# EAGLE design 3way d-sub (EAGLE 7.2.0)
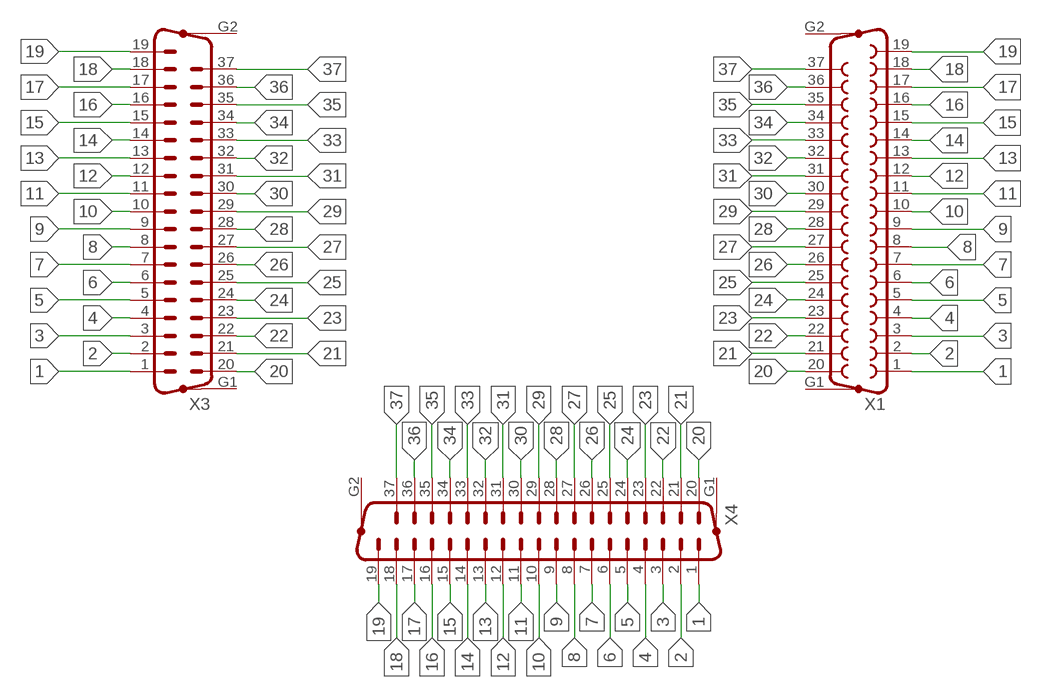
[diagram p0: schematic, sheet 1]

## Parts
X1  F37HP  [F37HP]
X3  M37HP  [M37HP]
X4  M37HP  [M37HP]

## Nets
1: X1.1 X3.1 X4.1
2: X1.2 X3.2 X4.2
3: X1.3 X3.3 X4.3
4: X1.4 X3.4 X4.4
5: X1.5 X3.5 X4.5
6: X1.6 X3.6 X4.6
7: X1.7 X3.7 X4.7
8: X1.8 X3.8 X4.8
9: X1.9 X3.9 X4.9
10: X1.10 X3.10 X4.10
11: X1.11 X3.11 X4.11
12: X1.12 X3.12 X4.12
13: X1.13 X3.13 X4.13
14: X1.14 X3.14 X4.14
15: X1.15 X3.15 X4.15
16: X1.16 X3.16 X4.16
17: X1.17 X3.17 X4.17
18: X1.18 X3.18 X4.18
19: X1.19 X3.19 X4.19
20: X1.20 X3.20 X4.20
21: X1.21 X3.21 X4.21
22: X1.22 X3.22 X4.22
23: X1.23 X3.23 X4.23
24: X1.24 X3.24 X4.24
25: X1.25 X3.25 X4.25
26: X1.26 X3.26 X4.26
27: X1.27 X3.27 X4.27
28: X1.28 X3.28 X4.28
29: X1.29 X3.29 X4.29
30: X1.30 X3.30 X4.30
31: X1.31 X3.31 X4.31
32: X1.32 X3.32 X4.32
33: X1.33 X3.33 X4.33
34: X1.34 X3.34 X4.34
35: X1.35 X3.35 X4.35
36: X1.36 X3.36 X4.36
37: X1.37 X3.37 X4.37
Unconnected: X1.G1 X1.G2 X3.G1 X3.G2 X4.G1 X4.G2

## Library data of the parts
X1 = con-subd:F37HP: SUB-D; OC_FARNELL: unknown; OC_NEWARK: unknown
X3 X4 = con-subd:M37HP: SUB-D; OC_FARNELL: unknown; OC_NEWARK: unknown

## Board
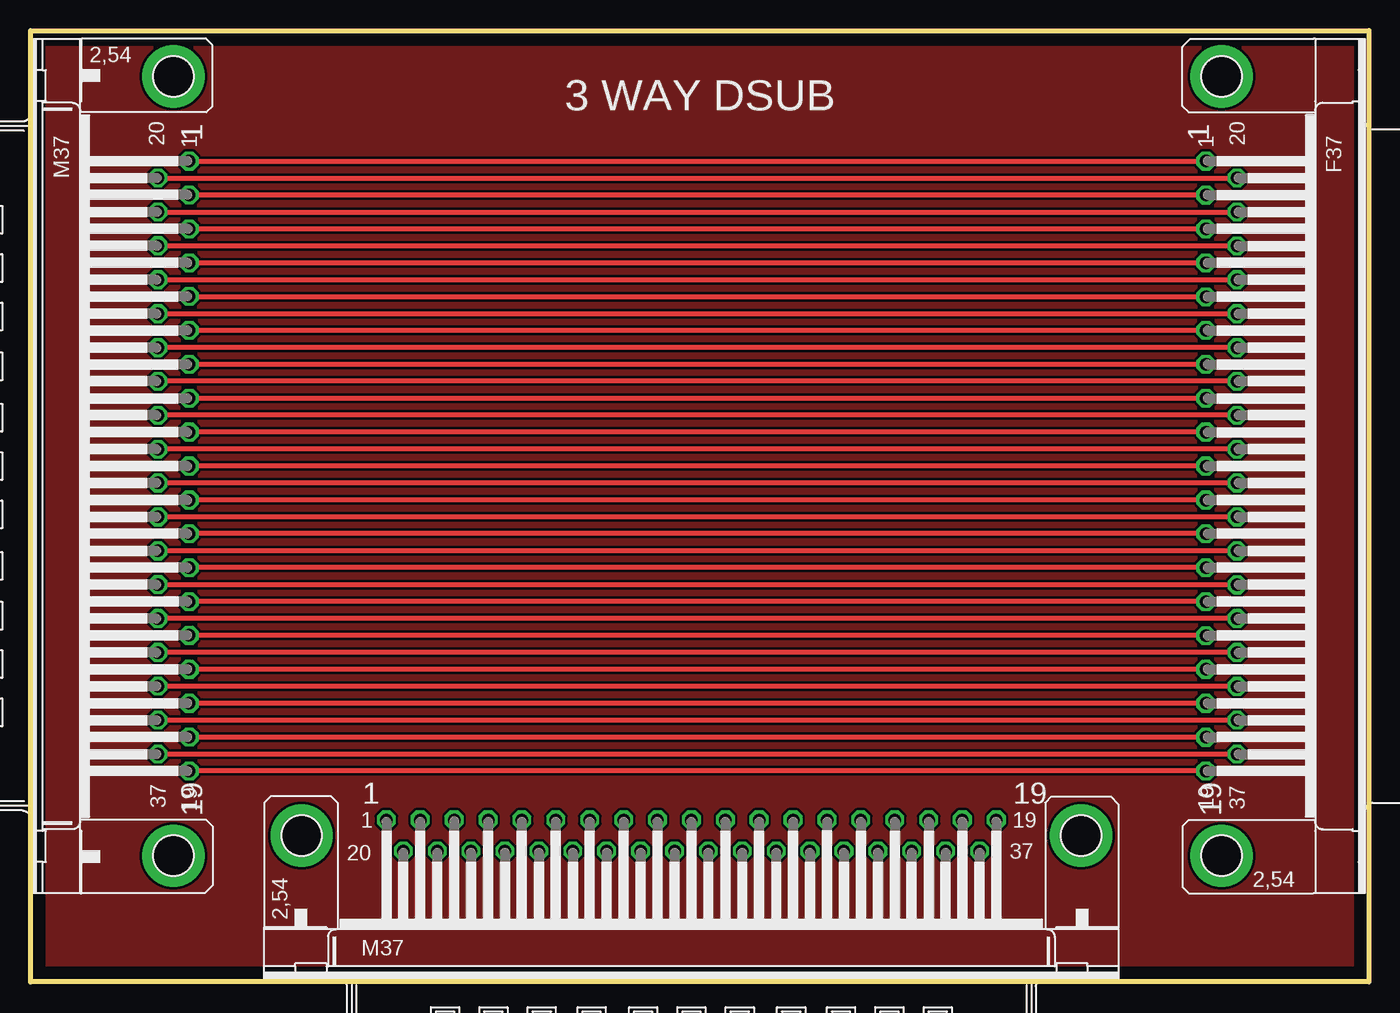
[diagram p1: board, top side]
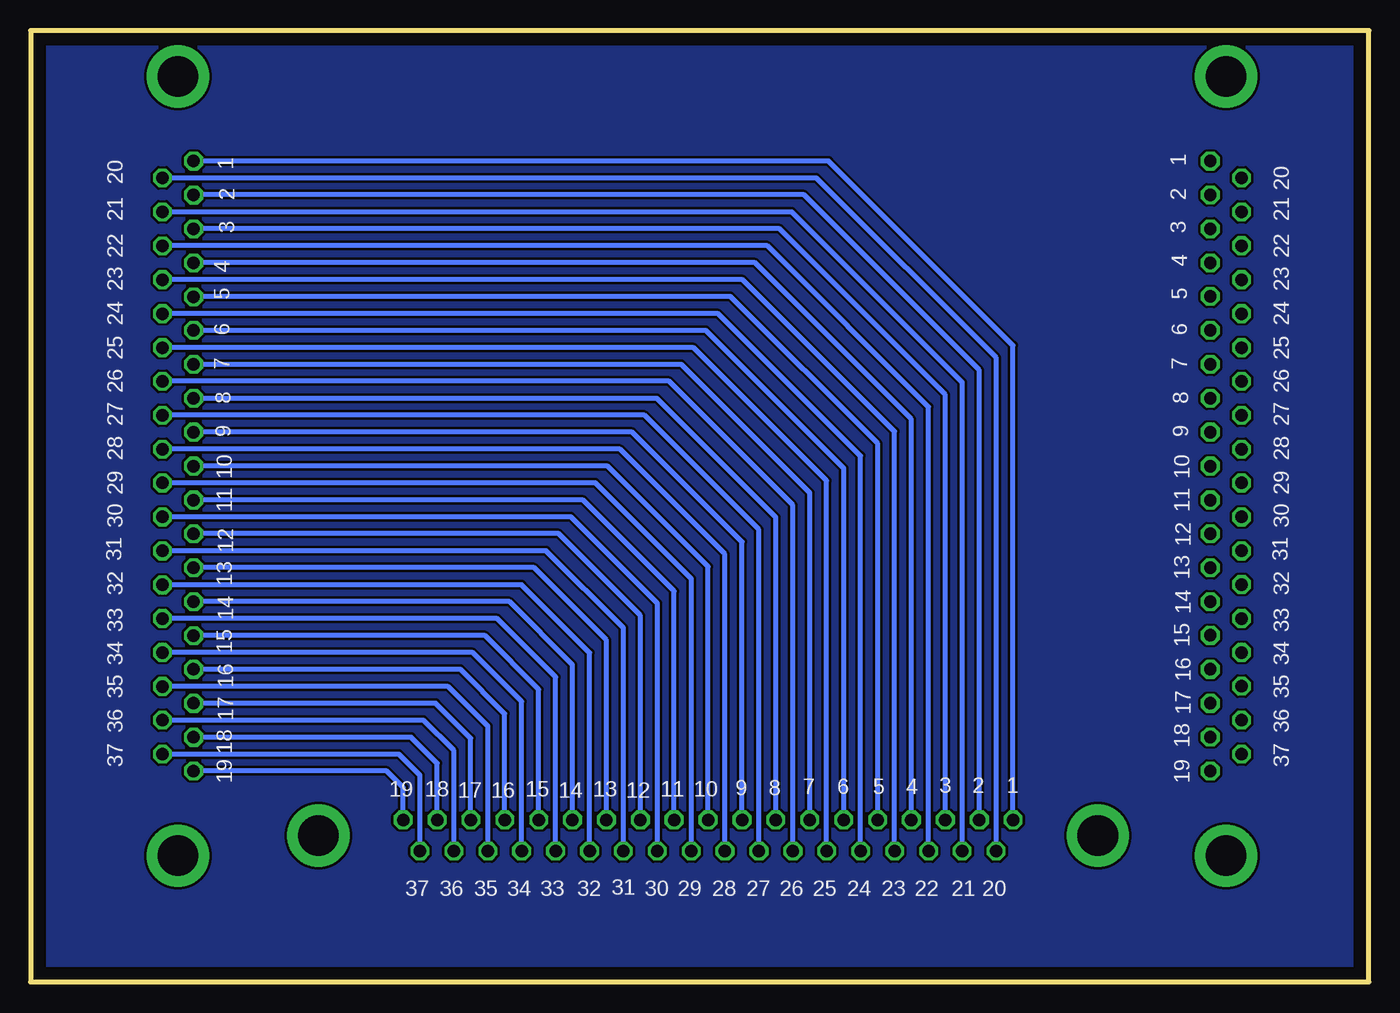
[diagram p2: board, bottom side, seen from below]

Size 109 x 77.5 mm. Coordinates in mm from the lower left corner, seen from the top.
Outline: 0,77.5 109,77.5 109,0 0,0 0,77.5
Copper layers (1*16): Top 0.035mm / dielectric 1.5mm / Bottom 0.035mm
Design rules "default": minimum track width 10mil, minimum drill 24mil, track to track 8mil, track to pad 8mil, pad to pad 8mil, via to via 8mil, smd to smd 8mil, copper to edge 40mil, drill to drill 8mil, minimum pad ring 10mil, minimum via ring 8mil, stop-mask expansion 4mil, vias tented up to drill 0mil, thermal gap 10mil

### Footprints (pad centres in the part's own frame; a part is rotated, then mirrored left to right if it is on the bottom)
F37HP = drill 1.016 octagon: 1 -24.841,-1.27; 2 -22.073,-1.27; 3 -19.329,-1.27; 4 -16.561,-1.27; 5 -13.792,-1.27; 6 -11.049,-1.27; 7 -8.28,-1.27; 8 -5.512,-1.27; 9 -2.769,-1.27; 10 0,-1.27; 11 2.769,-1.27; 12 5.512,-1.27; 13 8.28,-1.27; 14 11.049,-1.27; 15 13.818,-1.27; 16 16.561,-1.27; 17 19.329,-1.27; 18 22.098,-1.27; 19 24.841,-1.27; 20 -23.47,1.27; 21 -20.701,1.27; 22 -17.932,1.27; 23 -15.189,1.27; 24 -12.421,1.27; 25 -9.652,1.27; 26 -6.909,1.27; 27 -4.14,1.27; 28 -1.372,1.27; 29 1.372,1.27; 30 4.14,1.27; 31 6.909,1.27; 32 9.677,1.27; 33 12.421,1.27; 34 15.189,1.27; 35 17.958,1.27; 36 20.701,1.27; 37 23.47,1.27 | drill 3.302 pad 5.08: G1 -31.75,0; G2 31.75,0
M37HP = drill 1.016 octagon: 1 -24.841,1.27; 2 -22.098,1.27; 3 -19.329,1.27; 4 -16.561,1.27; 5 -13.818,1.27; 6 -11.049,1.27; 7 -8.28,1.27; 8 -5.512,1.27; 9 -2.769,1.27; 10 0,1.27; 11 2.769,1.27; 12 5.512,1.27; 13 8.28,1.27; 14 11.049,1.27; 15 13.792,1.27; 16 16.561,1.27; 17 19.329,1.27; 18 22.073,1.27; 19 24.841,1.27; 20 -23.47,-1.27; 21 -20.701,-1.27; 22 -17.958,-1.27; 23 -15.189,-1.27; 24 -12.421,-1.27; 25 -9.652,-1.27; 26 -6.909,-1.27; 27 -4.14,-1.27; 28 -1.372,-1.27; 29 1.372,-1.27; 30 4.14,-1.27; 31 6.909,-1.27; 32 9.652,-1.27; 33 12.421,-1.27; 34 15.189,-1.27; 35 17.932,-1.27; 36 20.701,-1.27; 37 23.47,-1.27 | drill 3.302 pad 5.08: G1 -31.75,0; G2 31.75,0

### Placement (x,y rotation side)
X1  97,42.03 270 top
X3  11.64,42.03 270 top
X4  53.82,11.93 0 top

### Tracks (layer width: path | path; a pad name or v marks a point on that pad's centre or on a via)
1
  Top 0.406: X3.1 X1.1
  Bottom 0.406: X4.1 28.98,51.85 44,66.87 X1.1
2
  Top 0.406: X3.2 95.73,64.13 X1.2
  Bottom 0.406: X4.2 31.72,49.85 46,64.13 95.7,64.13 X1.2
3
  Top 0.406: X3.3 X1.3
  Bottom 0.406: X4.3 34.49,47.85 48,61.36 X1.3
4
  Top 0.406: X3.4 X1.4
  Bottom 0.406: X4.4 37.26,45.85 50,58.59 X1.4
5
  Top 0.406: X3.5 95.73,55.85 X1.5
  Bottom 0.406: X4.5 40,43.85 52,55.85 95.7,55.85 X1.5
6
  Top 0.406: X1.6 X3.6
  Bottom 0.406: X4.6 42.77,41.85 54,53.08 X1.6
7
  Top 0.406: X1.7 X3.7
  Bottom 0.406: X4.7 45.54,39.85 56,50.31 X1.7
8
  Top 0.406: X1.8 X3.8
  Bottom 0.406: X4.8 48.31,37.85 58,47.54 X1.8
9
  Top 0.406: X1.9 X3.9
  Bottom 0.406: X4.9 51.05,35.85 60,44.8 X1.9
10
  Top 0.406: X1.10 X3.10
  Bottom 0.406: X4.10 53.82,33.85 62,42.03 X1.10
11
  Top 0.406: X1.11 X3.11
  Bottom 0.406: X4.11 56.59,31.85 64,39.26 X1.11
12
  Top 0.406: X1.12 X3.12
  Bottom 0.406: X4.12 59.33,29.85 66,36.52 X1.12
13
  Top 0.406: X1.13 X3.13
  Bottom 0.406: X4.13 62.1,27.85 68,33.75 X1.13
14
  Top 0.406: X1.14 X3.14
  Bottom 0.406: X4.14 64.87,25.85 70,30.98 X1.14
15
  Top 0.406: X1.15 12.91,28.21 X3.15
  Bottom 0.406: X4.15 67.61,23.82 72,28.21 X1.15
16
  Top 0.406: X1.16 X3.16
  Bottom 0.406: X4.16 70.38,21.85 74,25.47 X1.16
17
  Top 0.406: X1.17 X3.17
  Bottom 0.406: X4.17 73.15,19.85 76,22.7 X1.17
18
  Top 0.406: X1.18 12.91,19.93 X3.18
  Bottom 0.406: X4.18 75.89,17.82 78,19.93 X1.18
19
  Top 0.406: X1.19 X3.19
  Bottom 0.406: X4.19 78.66,15.85 80,17.19 X1.19
20
  Top 0.406: X3.20 X1.20
  Bottom 0.406: X4.20 30.35,50.85 45,65.5 X1.20
21
  Top 0.406: X3.21 X1.21
  Bottom 0.406: X4.21 33.12,48.85 47,62.73 X1.21
22
  Top 0.406: X3.22 98.25,59.99 X1.22
  Bottom 0.406: X4.22 35.86,46.85 49,59.99 98.25,59.99 X1.22
23
  Top 0.406: X3.23 X1.23
  Bottom 0.406: X4.23 38.63,44.85 51,57.22 X1.23
24
  Top 0.406: X3.24 X1.24
  Bottom 0.406: X4.24 41.4,42.85 53,54.45 X1.24
25
  Top 0.406: X1.25 X3.25
  Bottom 0.406: X4.25 44.17,40.85 55,51.68 X1.25
26
  Top 0.406: X1.26 X3.26
  Bottom 0.406: X4.26 46.91,38.85 57,48.94 X1.26
27
  Top 0.406: X1.27 X3.27
  Bottom 0.406: X4.27 49.68,36.85 59,46.17 X1.27
28
  Top 0.406: X1.28 X3.28
  Bottom 0.406: X4.28 52.45,34.85 61,43.4 X1.28
29
  Top 0.406: X1.29 X3.29
  Bottom 0.406: X4.29 55.19,32.85 63,40.66 X1.29
30
  Top 0.406: X1.30 X3.30
  Bottom 0.406: X4.30 57.96,30.85 65,37.89 X1.30
31
  Top 0.406: X1.31 X3.31
  Bottom 0.406: X4.31 60.73,28.85 67,35.12 X1.31
32
  Top 0.406: X1.32 10.37,32.35 X3.32
  Bottom 0.406: X4.32 63.47,26.83 69,32.35 X1.32
33
  Top 0.406: X1.33 X3.33
  Bottom 0.406: X4.33 66.24,24.85 71,29.61 X1.33
34
  Top 0.406: X1.34 X3.34
  Bottom 0.406: X4.34 69.01,22.85 73,26.84 X1.34
35
  Top 0.406: X1.35 10.37,24.07 X3.35
  Bottom 0.406: X4.35 71.75,20.82 75,24.07 X1.35
36
  Top 0.406: X1.36 X3.36
  Bottom 0.406: X4.36 74.52,18.85 77,21.33 X1.36
37
  Top 0.406: X1.37 X3.37
  Bottom 0.406: X4.37 77.29,16.85 79,18.56 X1.37
N$1
  pour Top: 0,77.5 109,77.5 109,0 0,0
N$2
  pour Bottom: 0,77.5 109,77.5 109,0 0,0

### Text on the board
tNames: 3 WAY DSUB | 1 | 1 | 1 | 19 | 19 | 19
bNames: 1 | 1 | 20 | 20 | 2 | 2 | 21 | 21 | 3 | 3 | 22 | 4 | 22 | 4 | 23 | 23 | 5 | 5 | 24 | 24 | 6 | 6 | 25 | 25 | 7 | 7 | 26 | 26 | 8 | 8 | 27 | 27 | 9 | 9 | 28 | 28 | 10 | 10 | 29 | 29 | 11 | 11 | 30 | 30 | 12 | 31 | 12 | 31 | 13 | 13 | 32 | 32 | 14 | 14 | 33 | 33 | 15 | 15 | 34 | 34 | 16 | 16 | 35 | 35 | 17 | 17 | 36 | 36 | 18 | 18 | 37 | 37 | 19 | 19 | 1 | 2 | 3 | 4 | 5 | 6 | 7 | 8 | 9 | 10 | 11 | 13 | 15 | 18 | 19 | 12 | 14 | 16 | 17 | 31 | 20 | 21 | 22 | 23 | 24 | 25 | 26 | 27 | 28 | 29 | 30 | 32 | 33 | 34 | 35 | 36 | 37